# EAGLE design v22_50_maker (EAGLE 9.0.1)
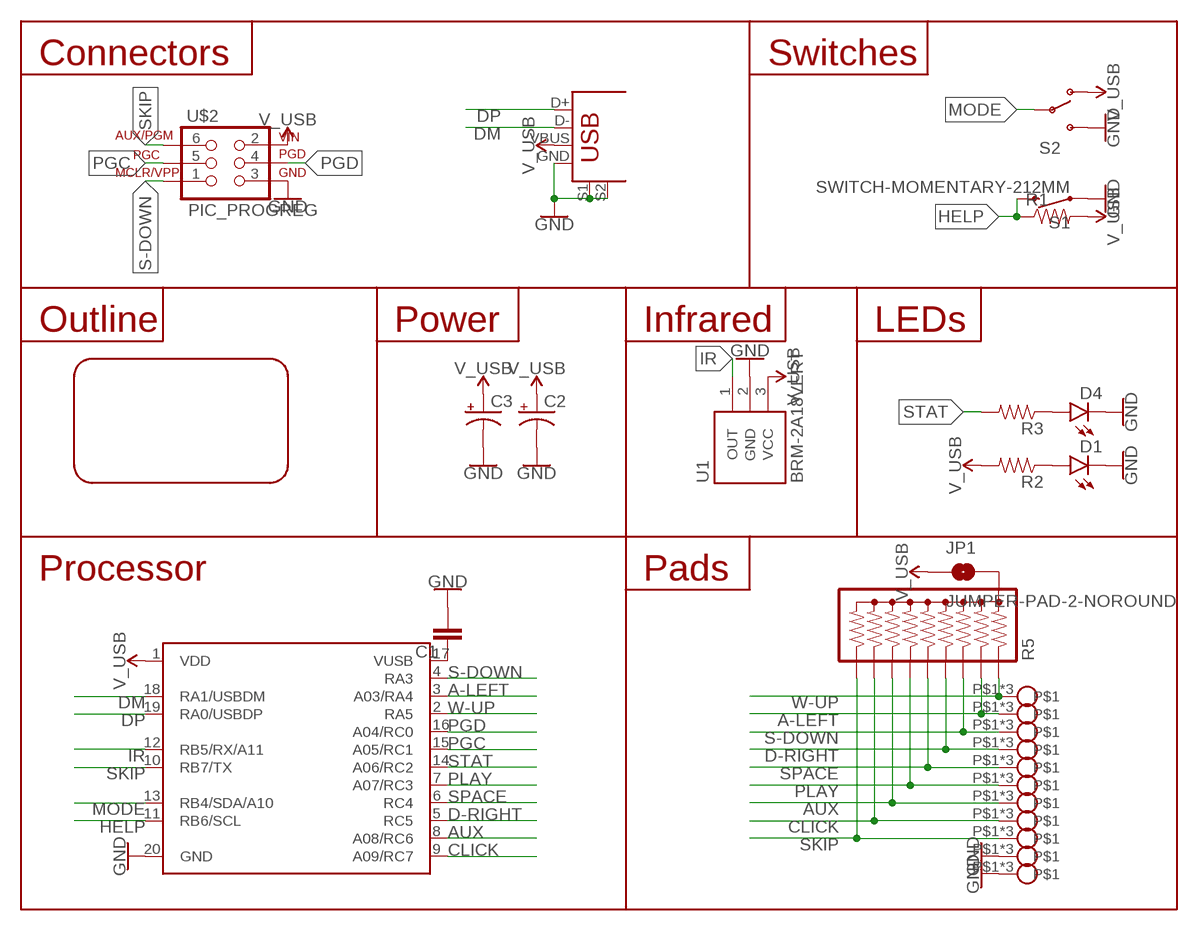
[diagram p0: schematic, sheet 1]

## Parts
C1  CAPPTH  [CAP-PTH-SMALL]
C2  CAP_POLPTH2  [CPOL-RADIAL-10UF-25V]
C3  CAP_POLPTH1  [CPOL-RADIAL-100UF-25V]
D1  LED3MM  [LED3MM]
D4  LED3MM  [LED3MM]
JP1  JUMPER-PAD-2-NOROUND  [PAD-JUMPER-2-NO_YES_SILK_ROUND]
R1  RESISTORAXIAL-0.3  [AXIAL-0.3]
R2  RESISTORAXIAL-0.3  [AXIAL-0.3]
R3  RESISTORAXIAL-0.3  [AXIAL-0.3]
R5  RPACK-BUSSED-9ROUND  [RPACK-SIP-PTH-9]
S1  SWITCH-MOMENTARY-212MM  [TACTILE-PTH-12MM]
S2  SWITCH-SPDTPTH  [SWITCH-SPDT]
U1  BRM-2A18VERT  [BRM-2508_VERT]
U$1  PIC16F1459-I/MLDIL  [DIL20]
U$2  PIC_PROGREG  [1X06]
U$3  USB+SHIELD  [USB-B-PTH]
U$4  ALLIGATOR  [ALLIGATOR_CLIP_CONNECTOR]
U$5  ALLIGATOR  [ALLIGATOR_CLIP_CONNECTOR]
U$6  ALLIGATOR  [ALLIGATOR_CLIP_CONNECTOR]
U$7  ALLIGATOR  [ALLIGATOR_CLIP_CONNECTOR]
U$8  ALLIGATOR  [ALLIGATOR_CLIP_CONNECTOR]
U$9  ALLIGATOR  [ALLIGATOR_CLIP_CONNECTOR]
U$10  ALLIGATOR  [ALLIGATOR_CLIP_CONNECTOR]
U$11  ALLIGATOR  [ALLIGATOR_CLIP_CONNECTOR]
U$12  ALLIGATOR  [ALLIGATOR_CLIP_CONNECTOR]
U$13  ALLIGATOR  [ALLIGATOR_CLIP_CONNECTOR]
U$14  ALLIGATOR  [ALLIGATOR_CLIP_CONNECTOR]
U$15  CARD_STANDARD50MM  [IEC-7810_ID-1_50MM]

## Nets
A-LEFT: R5.P$3 U$1.3(A03/RA4) U$4.P$1 U$4.P$2 U$4.P$3
AUX: R5.P$8 U$1.8(A08/RC6) U$10.P$1 U$10.P$2 U$10.P$3
CLICK: R5.P$9 U$1.9(A09/RC7) U$11.P$1 U$11.P$2 U$11.P$3
D-RIGHT: R5.P$5 U$1.5(RC5) U$5.P$1 U$5.P$2 U$5.P$3
DM: U$1.18(RA1/USBDM) U$3.D-
DP: U$1.19(RA0/USBDP) U$3.D+
GND: C1.2 C2.2(-) C3.2(-) D1.K(C) D4.K(C) S1.1 S1.2 S2.3(S) U1.2(GND) U$1.20(GND) U$2.3(GND) U$3.GND U$3.S1 U$3.S2 U$13.P$1 U$13.P$2 U$13.P$3 U$14.P$1 U$14.P$2 U$14.P$3
HELP: R1.P$1 S1.3 S1.4 U$1.11(RB6/SCL)
IR: U1.1(OUT) U$1.12(RB5/RX/A11)
MODE: S2.2(P) U$1.13(RB4/SDA/A10)
N$1: D4.A R3.P$1
N$5: C1.1 U$1.17(VUSB)
N$6: JP1.2 R5.P$1
N$7: D1.A R2.P$1
PGC: U$1.15(A05/RC1) U$2.5(PGC)
PGD: U$1.16(A04/RC0) U$2.4(PGD)
PLAY: R5.P$7 U$1.7(A07/RC3) U$9.P$1 U$9.P$2 U$9.P$3
S-DOWN: R5.P$4 U$1.4(RA3) U$2.1(MCLR/VPP) U$7.P$1 U$7.P$2 U$7.P$3
SKIP: R5.P$10 U$1.10(RB7/TX) U$2.6(AUX/PGM) U$12.P$1 U$12.P$2 U$12.P$3
SPACE: R5.P$6 U$1.6(RC4) U$8.P$1 U$8.P$2 U$8.P$3
STAT: R3.P$2 U$1.14(A06/RC2)
V_USB: C2.1(+) C3.1(+) JP1.1 R1.P$2 R2.P$2 S2.1(O) U1.3(VCC) U$1.1(VDD) U$2.2(VIN) U$3.VBUS
W-UP: R5.P$2 U$1.2(RA5) U$6.P$1 U$6.P$2 U$6.P$3

## Notes on the sheet
- Connectors | Switches
- Outline | Power | Infrared | LEDs
- Processor | Pads

## Library data of the parts
C1 = SparkFun-Capacitors:CAP: Capacitor Standard 0603 ceramic capacitor, and 0.1" leaded capacitor.
C2 C3 = SparkFun-Capacitors:CAP_POL: Capacitor Polarized These are standard SMD and PTH capacitors. Normally 10uF, 47uF, and 100uF in electrolytic and tantalum varieties. Always verify the external diameter of the through hole cap, it varies with capacity, voltage, and manufacturer. The EIA devices should be standard.
D1 D4 = SparkFun-LED:LED: LEDs Standard schematic elements and footprints for 5mm, 3mm, 1206, and 0603 sized LEDs. 5mm - Spark Fun Electronics SKU : COM-00529 (and others); PROD_ID: DIO-08794
JP1 = SparkFun-Passives:JUMPER-PAD-2-NO
R1-R3 = SparkFun-Resistors:RESISTOR: Resistor Basic schematic elements and footprints for 0603, 1206, and PTH resistors.
R5 = maxorig:RPACK-BUSSED-9: BOURNS 4600X/R series thick-film SIP resistor packs Height resistors bussed to a single pin (denoted by dot). datasheet <http://dlnmh9ip6v2uc.cloudfront.net/datasheets/Components/General/4600x.pdf> SIMILAR TO: SFE parts COM-10855 (330), COM-10856 (10K)
S1 = maxorig:SWITCH-MOMENTARY-2: Various NO switches- pushbuttons, reed, etc; PROD_ID: SWCH-09185
S2 = SparkFun-Electromechanical:SWITCH-SPDT: SPDT Switch Simple slide switch, Spark Fun Electronics SKU : COM-00102 DPDT SMT slide switch, AYZ0202, SWCH-08179; PROD_ID: SWCH-08261
U1 = SparkFun-Sensors:BRM-2A18: BRM-2A18 IR receiver.; PROD_ID: COMP-12505
U$1 = maxorig:PIC16F1459-I/ML
U$2 = maxorig:PIC_PROG: 2x3 0.1' connector for programming and debugging PIC MCUs. PGM/LVP pin can be used for alternate modes if not required by target MCU
U$3 = SparkFun-Connectors:USB+SHIELD: USB+Shield USB connector with shield pins connectable
U$4-U$14 = maxorig:ALLIGATOR
U$15 = maxorig:CARD_STANDARD: Business card size board outline meeting IEC-7810 ID-1 standards. To fully meet spec, use with a 0.6mm or 0.8mm thick PCB. Paneled versions are 50mm high vs the 53mm in the spec to allow for two to be fit on a 100x100mm board for cost reductions.

## Board
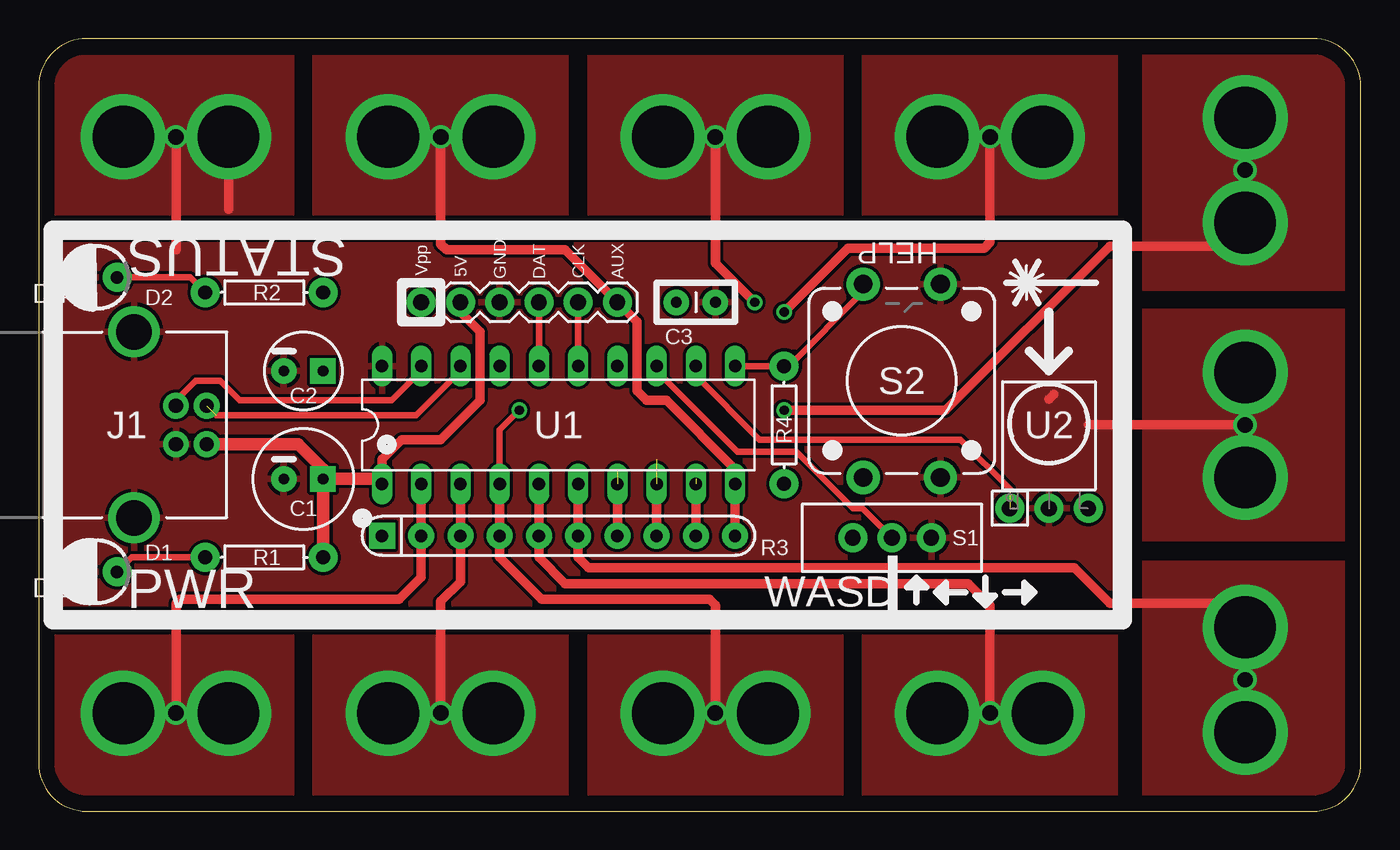
[diagram p1: board, top side]
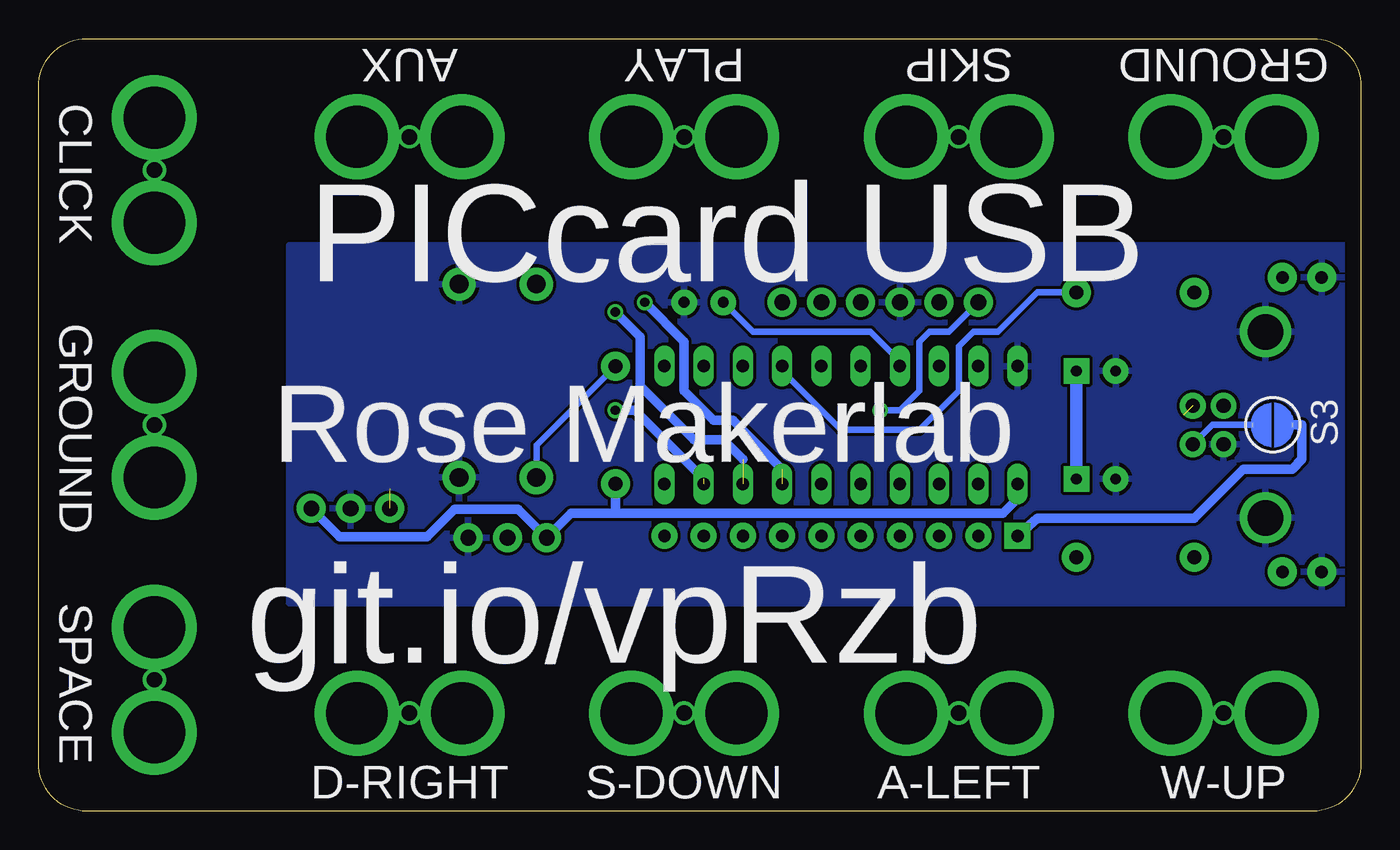
[diagram p2: board, bottom side, seen from below]

Size 85.6 x 50 mm. Coordinates in mm from the lower left corner, seen from the top.
Copper layers (1*16): Top 0.035mm / dielectric 1.5mm / Bottom 0.035mm
Design rules "default *": minimum track width 10mil, minimum drill 24mil, track to track 8mil, track to pad 8mil, pad to pad 8mil, via to via 8mil, smd to smd 8mil, copper to edge 40mil, drill to drill 8mil, minimum pad ring 10mil, minimum via ring 8mil, stop-mask expansion 4mil, vias tented up to drill 25mil, thermal gap 10mil

### Footprints (pad centres in the part's own frame; a part is rotated, then mirrored left to right if it is on the bottom)
CAP-PTH-SMALL = drill 0.7 pad 1.651: 1 0,0; 2 2.54,0
CPOL-RADIAL-10UF-25V = drill 0.7 pad 1.651 square: 1 1.27,0 | drill 0.7 pad 1.651: 2 -1.27,0
CPOL-RADIAL-100UF-25V = drill 0.7 pad 1.651 square: 1 1.27,0 | drill 0.7 pad 1.651: 2 -1.27,0
LED3MM = drill 0.813 pad 1.88: A -1.27,0; K 1.27,0
PAD-JUMPER-2-NO_YES_SILK_ROUND = smd 0.152 x 0.305: 1 -1.27,0; 2 1.27,0
AXIAL-0.3 = drill 0.9 pad 1.88: P$1 -3.81,0; P$2 3.81,0
RPACK-SIP-PTH-9 = drill 0.8 pad 1.676 square: P$1 0,0 | drill 0.8 pad 1.676: P$2 0,-2.54; P$3 0,-5.08; P$4 0,-7.62; P$5 0,-10.16; P$6 0,-12.7; P$7 0,-15.24; P$8 0,-17.78; P$9 0,-20.32; P$10 0,-22.86
TACTILE-PTH-12MM = drill 1.2 pad 2.159: 1 6.25,-2.5; 2 -6.25,-2.5; 3 6.25,2.5; 4 -6.25,2.5
SWITCH-SPDT = drill 1.016 pad 1.88: 1 0,2.54; 2 0,0; 3 0,-2.54
BRM-2508_VERT = drill 1.016 pad 1.88: 1 -2.54,0; 2 0,0; 3 2.54,0
DIL20 = drill 0.813 long: 1 -11.43,-3.81; 2 -8.89,-3.81; 3 -6.35,-3.81; 4 -3.81,-3.81; 5 -1.27,-3.81; 6 1.27,-3.81; 7 3.81,-3.81; 8 6.35,-3.81; 9 8.89,-3.81; 10 11.43,-3.81; 11 11.43,3.81; 12 8.89,3.81; 13 6.35,3.81; 14 3.81,3.81; 15 1.27,3.81; 16 -1.27,3.81; 17 -3.81,3.81; 18 -6.35,3.81; 19 -8.89,3.81; 20 -11.43,3.81
1X06 = drill 1.016 pad 1.88: 1 0,0; 2 2.54,0; 3 5.08,0; 4 7.62,0; 5 10.16,0; 6 12.7,0
USB-B-PTH = drill 0.914 pad 1.676: D+ 0,1.25; D- 1.981,1.25; GND 0,-1.25; VBUS 1.981,-1.25 | drill 2.286: S1 -2.718,-6.02; S2 -2.718,6.02
ALLIGATOR_CLIP_CONNECTOR = drill 4 pad 5.5: P$1 -3.4,0; P$2 3.4,0 | drill 1: P$3 0,0

### Placement (x,y rotation side)
C1  41.27,32.94 0 top
C2  17.14,28.49 0 top
C3  17.14,21.51 0 top
D1  3.81,15.49 180 top
D4  3.81,34.54 180 top
JP1  5.71,25 0 bottom
R1  48.26,25 270 top
R2  14.61,16.43 0 top
R3  14.61,33.57 0 top
R5  22.23,17.82 90 top
S1  55.88,27.86 90 top
S2  55.24,17.7 90 top
U1  65.41,19.6 0 top
U$1  33.66,25 0 top
U$2  24.77,32.94 0 top
U$3  8.89,25 0 top
U$4  26.04,6.35 180 top
U$5  61.59,6.35 180 top
U$6  8.89,6.35 180 top
U$7  43.81,6.35 0 top
U$8  78.11,8.51 270 top
U$9  43.81,43.65 0 top
U$10  61.59,43.65 0 top
U$11  78.11,41.49 270 top
U$12  26.04,43.65 180 top
U$13  8.89,43.65 0 top
U$14  78.11,25 270 top
U$15  0,0 0 top

### Tracks (layer width: path | path; a pad name or v marks a point on that pad's centre or on a via)
A-LEFT
  Top 0.61: U$4.P$3 26.04,13.59 27.3,14.86 R5.P$3 U$1.3
  pour Top (no thermals): 34.29,11.43 34.29,0 17.78,0 17.78,11.43
AUX  (via drill 0.6)  (1 unrouted)
  Top 0.61: v48.26,32.3 52.41,36.45 61.21,36.45 61.59,36.83 U$10.P$3 | U$1.8 R5.P$8
  Bottom 0.61: 40.01,22.78 41.27,24.05 43.18,24.05 46.67,27.54 46.67,30.71 v48.26,32.3
  pour Top (no thermals): 53.34,49.36 69.85,49.36 69.85,38.56 53.34,38.56
CLICK  (via drill 0.6)  (1 unrouted)
  Top 0.61: v48.26,25.95 58.72,25.95 69.34,36.58 77.61,36.58 U$11.P$2 | U$1.9 R5.P$9
  Bottom 0.61: 42.55,21.51 46.99,25.95 v48.26,25.95
  pour Top (no thermals): 71.44,50.31 71.44,33.72 90.49,33.72 90.49,54.29
D-RIGHT
  Top 0.61: U$5.P$3 61.59,13.34 60.2,14.73 34.08,14.73 32.38,16.43 R5.P$5 U$1.5
  pour Top (no thermals): 69.85,11.43 69.85,0 53.34,0 53.34,11.43
DM  (1 unrouted)
  Top 0.406: U$1.18 27.3,28.49 24.45,25.64 11.49,25.64
DP
  Top 0.406: U$1.19 24.77,28.49 22.86,26.59 13.02,26.59 11.75,27.86 10.16,27.86 8.89,26.59 U$3.D+
GND
  Top 0.61: U$13.P$2 12.29,38.96 | 65.72,26.99 65.41,26.67 | U$13.P$3 8.89,36.32 | U$14.P$3 67.96,25
  pour Bottom: -0.07,13.46 69.38,13.46 69.38,36.63 -0.07,36.63
  pour Top: 69.38,13.46 -0.07,13.46 -0.07,36.63 69.38,36.63
  pour Top (no thermals): 16.51,49.36 16.51,38.56 0,38.56 0,49.36
  pour Top (no thermals): 71.44,32.49 71.44,17.51 90.17,17.51 90.17,32.49
HELP
  Top 0.406: S1.3 53.38,33.61 48.58,28.81 R1.P$1 U$1.11
  Bottom 0.406: S1.4 53.38,23.69 R1.P$1
IR  (1 unrouted)
  Top 0.406: U$1.12 42.55,28.18 46.67,24.05 59.69,24.05 62.87,20.87
MODE
  Top 0.406: U$1.13 40.01,28.49 45.24,23.25 49.05,23.25 52.7,19.6 53.34,19.6 S2.2
N$1
  Top 0.406: 5.42,34.21 D4.A 9.82,34.54 R3.P$1
N$5
  Bottom 0.406: U$1.17 29.84,29.13 31.75,31.03 39.37,31.03 C1.1
N$6
  Bottom 0.61: R5.P$1 20.95,18.97 10.79,18.97 7.62,22.14 4.45,22.14 3.81,22.78 3.81,25 JP1.2
N$7
  Top 0.406: D1.A 5.27,15.68 5.38,15.79 6.01,16.43 R2.P$1
PGC
  Top 0.406: U$2.5 U$1.15
PGD
  Top 0.406: U$1.16 U$2.4
PLAY  (via drill 0.6)  (1 unrouted)
  Top 0.61: v46.35,32.94 43.81,35.48 U$9.P$3 | U$1.7 R5.P$7
  Bottom 0.61: v46.35,32.94 43.81,30.4 43.81,27.22 41.91,25.32 40.64,25.32 37.47,22.14
  pour Top (no thermals): 35.56,49.36 52.07,49.36 52.07,38.56 35.56,38.56
S-DOWN  (via drill 0.6)
  Top 0.406: U$1.4 29.84,24.68 v31.11,25.95
  Top 0.61: U$7.P$3 43.81,13.34 43.43,13.72 32.56,13.72 29.84,16.43 R5.P$4 U$1.4
  Bottom 0.406: v31.11,25.95 29.84,25.95 28.57,27.22 28.57,30.4 27.94,31.03 26.67,31.03 U$2.1
  pour Top (no thermals): 52.07,11.43 52.07,0 35.56,0 35.56,11.43
SKIP
  Top 0.61: 30.48,43.01 29.84,43.65 U$12.P$1 29.21,43.65 | U$12.P$3 26.04,36.7 26.42,36.32 34.08,36.32 U$2.6 38.73,31.67 38.73,27.22 39.37,26.59 40.64,26.59 45.09,22.14 U$1.10 R5.P$10
  pour Top (no thermals): 17.78,49.36 34.29,49.36 34.29,38.56 17.78,38.56
SPACE
  Top 0.61: U$8.P$1 77.57,13.46 69.34,13.46 67.06,15.75 35.6,15.75 34.92,16.43 R5.P$6 U$1.6
  pour Top (no thermals): 71.44,16.19 71.44,-0.32 90.17,-0.32 90.17,16.19
STAT
  Bottom 0.406: U$1.14 37.47,28.49 33.66,24.68 28.57,24.68 26.04,27.22 26.04,30.08 25.08,31.03 23.5,31.03 20.95,33.57 R3.P$2
V_USB
  Top 0.61: U$1.1 22.23,22.78 23.5,24.05 26.04,24.05 28.57,26.59 28.57,31.03 27.3,32.3 U$2.2
  Top 0.813: C3.1 R2.P$2 | U$1.1 21.91,21.51 C3.1 | C3.1 18.41,22.14 16.81,23.75 U$3.VBUS
  Bottom 0.406: 22.23,20.24 U$1.1 | U$3.VBUS 9.62,25 JP1.1
  Bottom 0.61: 22.23,20.24 23.19,19.27 48.26,19.27 | 48.26,19.27 51.13,19.27 S2.1 54.57,19.56 58.67,19.56 60.45,17.78 66.12,17.78 U1.3 | R1.P$2 48.26,19.27
  Bottom 0.813: C2.1 C3.1
W-UP
  Top 0.61: U$6.P$3 8.89,13.46 9.14,13.72 23.32,13.72 24.77,15.16 R5.P$2 U$1.2
  pour Top (no thermals): 16.51,11.43 16.51,0.32 0,0.32 0,11.43

### Text on the board
tPlace: STATUS | HELP | Vpp | 5V | R2 | GND | DAT | CLK | AUX | D2 | C3 | S2 | C2 | J1 | U1 | R4 | U2 | C1 | S1 | D1 | R3 | R1 | PWR | WASD
bPlace: GROUND | SKIP | PLAY | AUX | CLICK | PICcard USB | S3 | GROUND | Rose Makerlab | git.io/vpRzb | SPACE | W-UP | A-LEFT | S-DOWN | D-RIGHT